# Altium schematic sheet Control.SchDoc
size A3; PageSetup: Record=PageOptions|CenterHorizontal=True|CenterVertical=True|PrintScale=1.00|XCorrection=1.00|YCorrection=1.00|PrintKind=1|BorderSize=5000000|LeftOffset=0|BottomOffset=0|Orientation=2|PaperLength=1000|PaperWidth=1000|Scale=100|PaperSource=7|PrintQuality=-3|MediaType=1|DitherType=10|PrintScaleMode=0|PaperKind=A3|PaperIndex=8
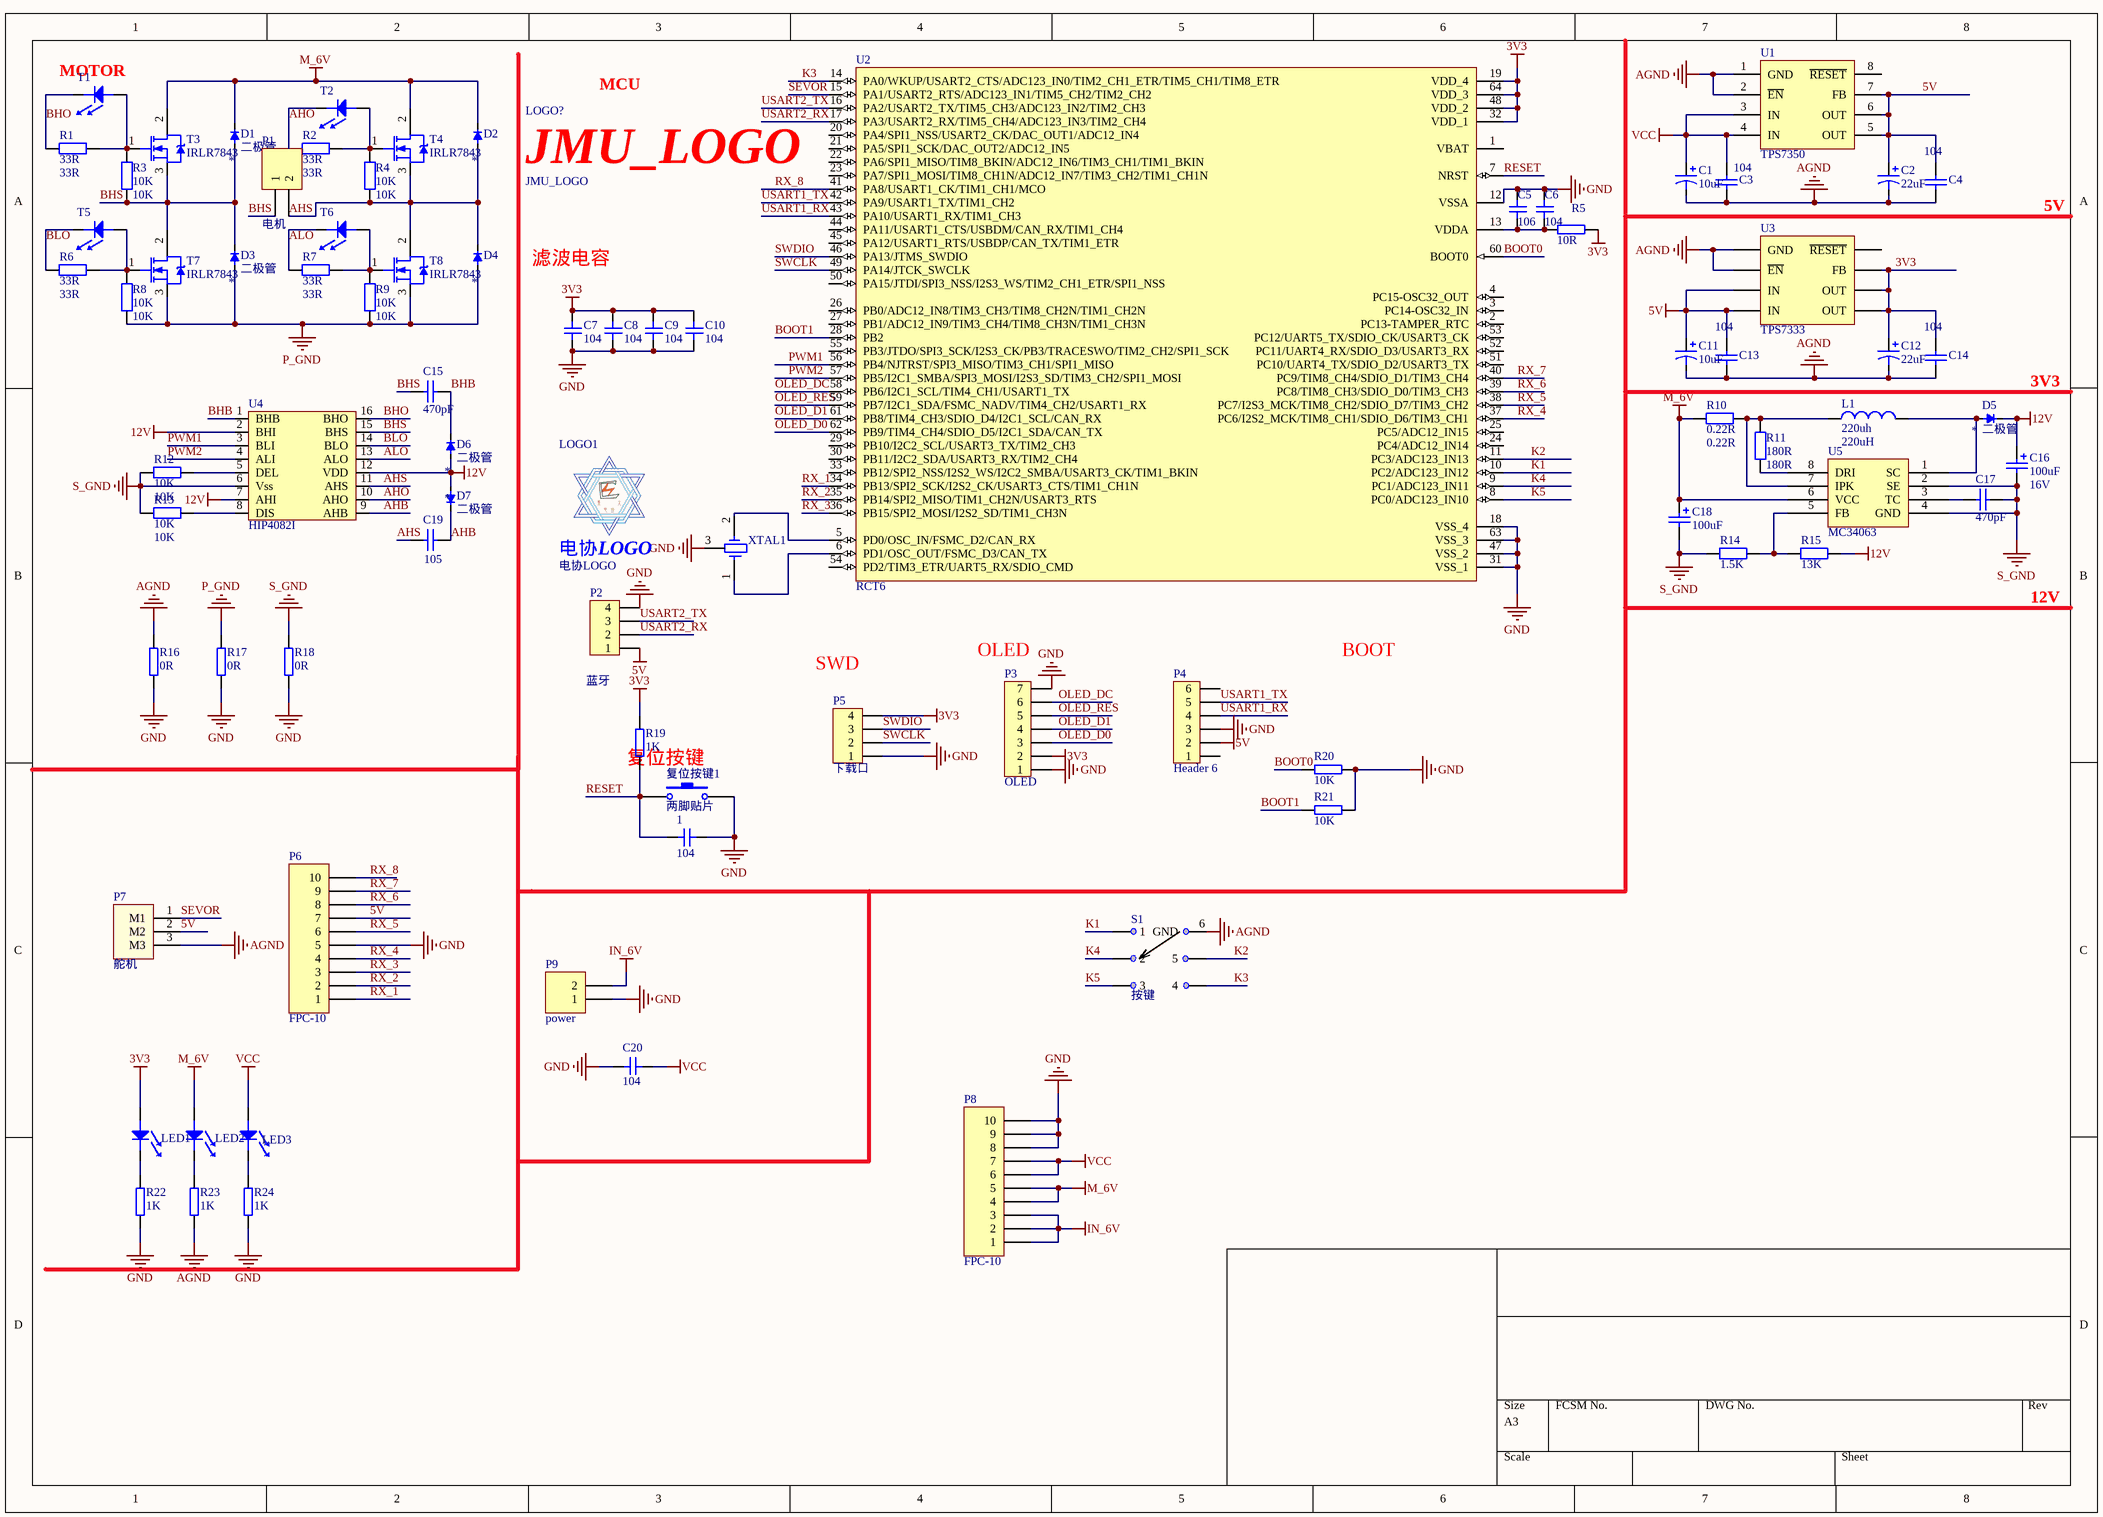
[diagram p0: Control.SchDoc]

## Parts
1  104  [0805C]
C1  10uF  [pol cap(10uF)]
C2  22uF  [pol cap(10uF)]
C3  104  [0805C]
C4  104  [0805C]
C5  106  [0805C]
C6  104  [0805C]
C7  104  [0805C]
C8  104  [0805C]
C9  104  [0805C]
C10  104  [0805C]
C11  10uF  [pol cap(10uF)]
C12  22uF  [pol cap(10uF)]
C13  104  [0805C]
C14  104  [0805C]
C15  470pf  [0805C]
C16  value 100uF  Voltage: 16V  [RB.8]  (hidden comment: Cap Pol SMT G)
C17  470pF  [0805C]
C18  100uF  [pol cap(10uF)]
C19  105  [0805C]
C20  104  [0805C]
D1  *  [二极管]
D2  *  [二极管]
D3  *  [二极管]
D4  *  [二极管]
D5  *  [二极管]
D6  *  [二极管]
D7  *  [二极管]
L1  220uh  [电感（220uh）]
LED1  LED3  [LED(0805)]  (value not drawn)
LED2  LED3  [LED(0805)]  (value not drawn)
LED3  LED2  [LED(0805)]  (value not drawn)
LOGO1  电协LOGO  [电协LOGO]
LOGO?  JMU_LOGO  [JMU_LOGO(1.35cm)]
P1  电机  [接线端子]
P2  蓝牙  [Header 4]
P3  OLED  [12864-0.96寸]
P4  Header 6  [Header 6]
P5  下载口  [Header 4]
P6  FPC-10  [FPC-10]
P7  舵机  [MX 1.25-WS-3P]
P8  FPC-10  [FPC-10]
P9  power  [接线端子]
R1  33R  [0603R]
R2  33R  [0603R]
R3  10K  [0603R]
R4  10K  [0603R]
R5  10R  [0805R]
R6  33R  [0603R]
R7  33R  [0603R]
R8  10K  [0603R]
R9  10K  [0603R]
R10  0.22R  [0805R]
R11  180R  [0805R]
R12  10K  [0603R]
R13  10K  [0603R]
R14  1.5K  [0805R]
R15  13K  [0805R]
R16  0R  [0805R]
R17  0R  [0805R]
R18  0R  [0805R]
R19  1K  [0805R]
R20  10K  [0805R]
R21  10K  [0805R]
R22  1K  [0805R]
R23  1K  [0805R]
R24  1K  [0805R]
S1  按键  [5轴按键]
T1  LED  [0805LED(BLUE)]  (value not drawn)
T2  LED  [0805LED(BLUE)]  (value not drawn)
T3  IRLR7843  [IRLR7843(MOS)]
T4  IRLR7843  [IRLR7843(MOS)]
T5  LED  [0805LED(BLUE)]  (value not drawn)
T6  LED  [0805LED(BLUE)]  (value not drawn)
T7  IRLR7843  [IRLR7843(MOS)]
T8  IRLR7843  [IRLR7843(MOS)]
U1  TPS7350  [SOIC-8]
U2  RCT6  [LQFP-64]
U3  TPS7333  [SOIC-8]
U4  HIP4082I  [HIP4082I]
U5  MC34063  [MA34063]
XTAL1  (no value)  [三脚贴片8M晶振]
复位按键1  两脚贴片  [贴片按键]

## Nets
3V3: C7.2 C8.2 C9.2 C10.2 C12.1 C14.2 LED1.1 P3.2 P5.4 R5.2 R19.2 U2.19(VDD_4) U2.32(VDD_1) U2.48(VDD_2) U2.64(VDD_3) U3.5(OUT) U3.6(OUT) U3.7(FB)
5V: C2.1 C4.2 C11.1 C13.2 P2.1 P4.2 P6.7 P7.2(M2) U1.5(OUT) U1.6(OUT) U1.7(FB) U3.3(IN) U3.4(IN)
12V: C16.1 D5.2(-) D6.1(+) D7.1(+) R15.2 U4.2(BHI) U4.7(AHI) U4.12(VDD)
AGND: C1.2 C2.2 C3.1 C4.1 C11.2 C12.2 C13.1 C14.1 P7.3(M3) R16.2 R23.1 S1.6(GND) U1.1(GND) U1.2(~{EN}) U3.1(GND) U3.2(~{EN})
GND: 1.2 C5.2 C6.2 C7.1 C8.1 C9.1 C10.1 C20.2 P2.4 P3.1 P3.7 P4.3 P5.1 P6.5 P8.8 P8.9 P8.10 P9.1 R16.1 R17.1 R18.1 R20.2 R21.1 R22.1 R24.1 U2.12(VSSA) U2.18(VSS_4) U2.31(VSS_1) U2.47(VSS_2) U2.63(VSS_3) XTAL1.3 复位按键1.2
IN_6V: P8.1 P8.2 P8.3 P9.2
M_6V: C18.1 D1.2(-) D2.2(-) LED2.1 P8.4 P8.5 R10.1 T3.2(D) T4.2(D) U5.6(VCC)
P_GND: D3.1(+) D4.1(+) R8.1 R9.1 R17.2 T7.3(S) T8.3(S)
S_GND: C16.2 C17.2 C18.2 R12.1 R13.1 R14.1 R18.2 U4.6(Vss) U5.2(SE) U5.4(GND)
VCC: C1.1 C3.2 C20.1 LED3.1 P8.6 P8.7 U1.3(IN) U1.4(IN)
AHB: C19.1 D7.2(-) U4.9(AHB)
AHO: R2.1 T2.2 U4.10(AHO)
AHS: C19.2 D2.1(+) D4.2(-) P1.2 R4.1 T4.3(S) T8.2(D) U4.11(AHS)
ALO: R7.1 T6.2 U4.13(ALO)
BHB: C15.2 D6.2(-) U4.1(BHB)
BHO: R1.1 T1.2 U4.16(BHO)
BHS: C15.1 D1.1(+) D3.2(-) P1.1 R3.1 T3.3(S) T7.2(D) U4.15(BHS)
BLO: R6.1 T5.2 U4.14(BLO)
BOOT0: R20.1 U2.60(BOOT0)
BOOT1: R21.2 U2.28(PB2)
K1: S1.1 U2.10(PC2/ADC123_IN12)
K2: S1.5 U2.11(PC3/ADC123_IN13)
K3: S1.4 U2.14(PA0/WKUP/USART2_CTS/ADC123_IN0/TIM2_CH1_ETR/TIM5_CH1/TIM8_ETR)
K4: S1.2 U2.9(PC1/ADC123_IN11)
K5: S1.3 U2.8(PC0/ADC123_IN10)
OLED_D0: P3.3 U2.62(PB9/TIM4_CH4/SDIO_D5/I2C1_SDA/CAN_TX)
OLED_D1: P3.4 U2.61(PB8/TIM4_CH3/SDIO_D4/I2C1_SCL/CAN_RX)
OLED_DC: P3.6 U2.58(PB6/I2C1_SCL/TIM4_CH1/USART1_TX)
OLED_RES: P3.5 U2.59(PB7/I2C1_SDA/FSMC_NADV/TIM4_CH2/USART1_RX)
PWM1: U2.56(PB4/NJTRST/SPI3_MISO/TIM3_CH1/SPI1_MISO) U4.3(BLI)
PWM2: U2.57(PB5/I2C1_SMBA/SPI3_MOSI/I2S3_SD/TIM3_CH2/SPI1_MOSI) U4.4(ALI)
RESET: 1.1 R19.1 U2.7(NRST) 复位按键1.1
RX_1: P6.1 U2.34(PB13/SPI2_SCK/I2S2_CK/USART3_CTS/TIM1_CH1N)
RX_2: P6.2 U2.35(PB14/SPI2_MISO/TIM1_CH2N/USART3_RTS)
RX_3: P6.3 U2.36(PB15/SPI2_MOSI/I2S2_SD/TIM1_CH3N)
RX_4: P6.4 U2.37(PC6/I2S2_MCK/TIM8_CH1/SDIO_D6/TIM3_CH1)
RX_5: P6.6 U2.38(PC7/I2S3_MCK/TIM8_CH2/SDIO_D7/TIM3_CH2)
RX_6: P6.8 U2.39(PC8/TIM8_CH3/SDIO_D0/TIM3_CH3)
RX_7: P6.9 U2.40(PC9/TIM8_CH4/SDIO_D1/TIM3_CH4)
RX_8: P6.10 U2.41(PA8/USART1_CK/TIM1_CH1/MCO)
SEVOR: P7.1(M1) U2.15(PA1/USART2_RTS/ADC123_IN1/TIM5_CH2/TIM2_CH2)
SWCLK: P5.2 U2.49(PA14/JTCK_SWCLK)
SWDIO: P5.3 U2.46(PA13/JTMS_SWDIO)
USART1_RX: P4.4 U2.43(PA10/USART1_RX/TIM1_CH3)
USART1_TX: P4.5 U2.42(PA9/USART1_TX/TIM1_CH2)
USART2_RX: P2.2 U2.17(PA3/USART2_RX/TIM5_CH4/ADC123_IN3/TIM2_CH4)
USART2_TX: P2.3 U2.16(PA2/USART2_TX/TIM5_CH3/ADC123_IN2/TIM2_CH3)
NetC5_1: C5.1 C6.1 R5.1 U2.13(VDDA)
NetC17_1: C17.1 U5.3(TC)
NetD5_1: D5.1(+) L1.2 U5.1(SC)
NetL1_1: L1.1 R10.2 R11.2 U5.7(IPK)
NetLED1_2: LED1.2 R22.2
NetLED2_2: LED2.2 R23.2
NetLED3_2: LED3.2 R24.2
NetR1_2: R1.2 R3.2 T1.1 T3.1(G)
NetR2_2: R2.2 R4.2 T2.1 T4.1(G)
NetR6_2: R6.2 R8.2 T5.1 T7.1(G)
NetR7_2: R7.2 R9.2 T6.1 T8.1(G)
NetR11_1: R11.1 U5.8(DRI)
NetR12_2: R12.2 U4.5(DEL)
NetR13_2: R13.2 U4.8(DIS)
NetR14_2: R14.2 R15.1 U5.5(FB)
NetU2_5: U2.5(PD0/OSC_IN/FSMC_D2/CAN_RX) XTAL1.2
NetU2_6: U2.6(PD1/OSC_OUT/FSMC_D3/CAN_TX) XTAL1.1

Not connected (* = marked no-connect by the designer): P4 1 6; U1 8(~{RESET}); U2 1(VBAT) 2(PC13-TAMPER_RTC) 3(PC14-OSC32_IN) 4(PC15-OSC32_OUT) 20(PA4/SPI1_NSS/USART2_CK/DAC_OUT1/ADC12_IN4) 21(PA5/SPI1_SCK/DAC_OUT2/ADC12_IN5) 22(PA6/SPI1_MISO/TIM8_BKIN/ADC12_IN6/TIM3_CH1/TIM1_BKIN) 23(PA7/SPI1_MOSI/TIM8_CH1N/ADC12_IN7/TIM3_CH2/TIM1_CH1N) 24(PC4/ADC12_IN14) 25(PC5/ADC12_IN15) 26(PB0/ADC12_IN8/TIM3_CH3/TIM8_CH2N/TIM1_CH2N) 27(PB1/ADC12_IN9/TIM3_CH4/TIM8_CH3N/TIM1_CH3N) 29(PB10/I2C2_SCL/USART3_TX/TIM2_CH3) 30(PB11/I2C2_SDA/USART3_RX/TIM2_CH4) 33(PB12/SPI2_NSS/I2S2_WS/I2C2_SMBA/USART3_CK/TIM1_BKIN) 44(PA11/USART1_CTS/USBDM/CAN_RX/TIM1_CH4) 45(PA12/USART1_RTS/USBDP/CAN_TX/TIM1_ETR) 50(PA15/JTDI/SPI3_NSS/I2S3_WS/TIM2_CH1_ETR/SPI1_NSS) 51(PC10/UART4_TX/SDIO_D2/USART3_TX) 52(PC11/UART4_RX/SDIO_D3/USART3_RX) 53(PC12/UART5_TX/SDIO_CK/USART3_CK) 54(PD2/TIM3_ETR/UART5_RX/SDIO_CMD) 55(PB3/JTDO/SPI3_SCK/I2S3_CK/PB3/TRACESWO/TIM2_CH2/SPI1_SCK); U3 8(~{RESET})

## Notes on the sheet
- (near T1) MOTOR
- MCU
- 5V
- 滤波电容
- 3V3
- (near P3) OLED
- BOOT
- 12V
- (near P5) SWD
- (near R19) 复位按键

## Library data of the parts
1 C5-C10 = C1
C1 C11 = pol cap: 通用有极电容; value: 22uF
C2 C12 = pol cap: 通用有极电容; value: 22uF
C3 C4 C13 C14 = Cap: 无极电容; Value: 104
C15 C17 C19 = Cap Semi: Capacitor (Semiconductor SIM Model); Published: 8-Jun-2000; LatestRevisionDate: 29-May-2009; LatestRevisionNote: IPC-7351 Footprint Added.; PackageReference: C1206; Publisher: Altium Limited; PackageDescription: Chip Capacitor
  C15 C17: Value: 470pF
  C19: Value: 105
C16 = Cap Pol SMT G: Polarized Capacitor (Radial); Published: 8-Jun-2000; Revision: July-2002: Re-released for DXP Platform.; Publisher: Altium Limited
C18 = Cap Pol1: Polarized Capacitor (Radial); Published: 8-Jun-2000; LatestRevisionDate: 17-Jul-2002; LatestRevisionNote: Re-released for DXP Platform.; PackageReference: RB7.6-15; Publisher: Altium Limited; PackageDescription: Polarized Capacitor (Radial); 2 Leads; Value: 100uF
C20 = Cap1: 无极贴片电容
D1-D7 = 二极管
L1 = Inductor: Value: 220uH
LED1-LED3 T1 T2 T5 T6 = LED: 发光二极管
LOGO? = JMU_LOGO: LOGO
P1 P9 = Header 2: Header, 2-Pin; LatestRevisionDate: 17-Jul-2002; LatestRevisionNote: Re-released for DXP Platform.; Publisher: Altium Limited
P2 P5 = Header 4
P3 = Header 7: 排针
P4 = Header 6: 排针
P6 P8 = FPC-10: 软排线底座
P7 = 接线端子-3PIN: 3PIN
R1-R4 R6-R15 = Res: 通用电阻
  R1 R2 R6 R7: Value: 33R
  R3 R4 R8 R9 R12 R13: Value: 10K
  R10: Value: 0.22R
  R11: Value: 180R
  R14: Value: 1.5K
  R15: Value: 13K
R5 R16-R24 = Res: 电阻
S1 = 5轴按键
T3 T4 T7 T8 = N_MOS(IRLR7843)
U1 = TPS7350: 稳压元件（5V）
U2 = STM32F103RCT6: STM32单片机64引脚
U3 = TPS7333: 稳压元件（3.3V）
XTAL1 = XTAL三脚贴片晶振
复位按键1 = Key(两脚贴片)